# Altium schematic sheet Gorilla OP schm.SchDoc
size A3
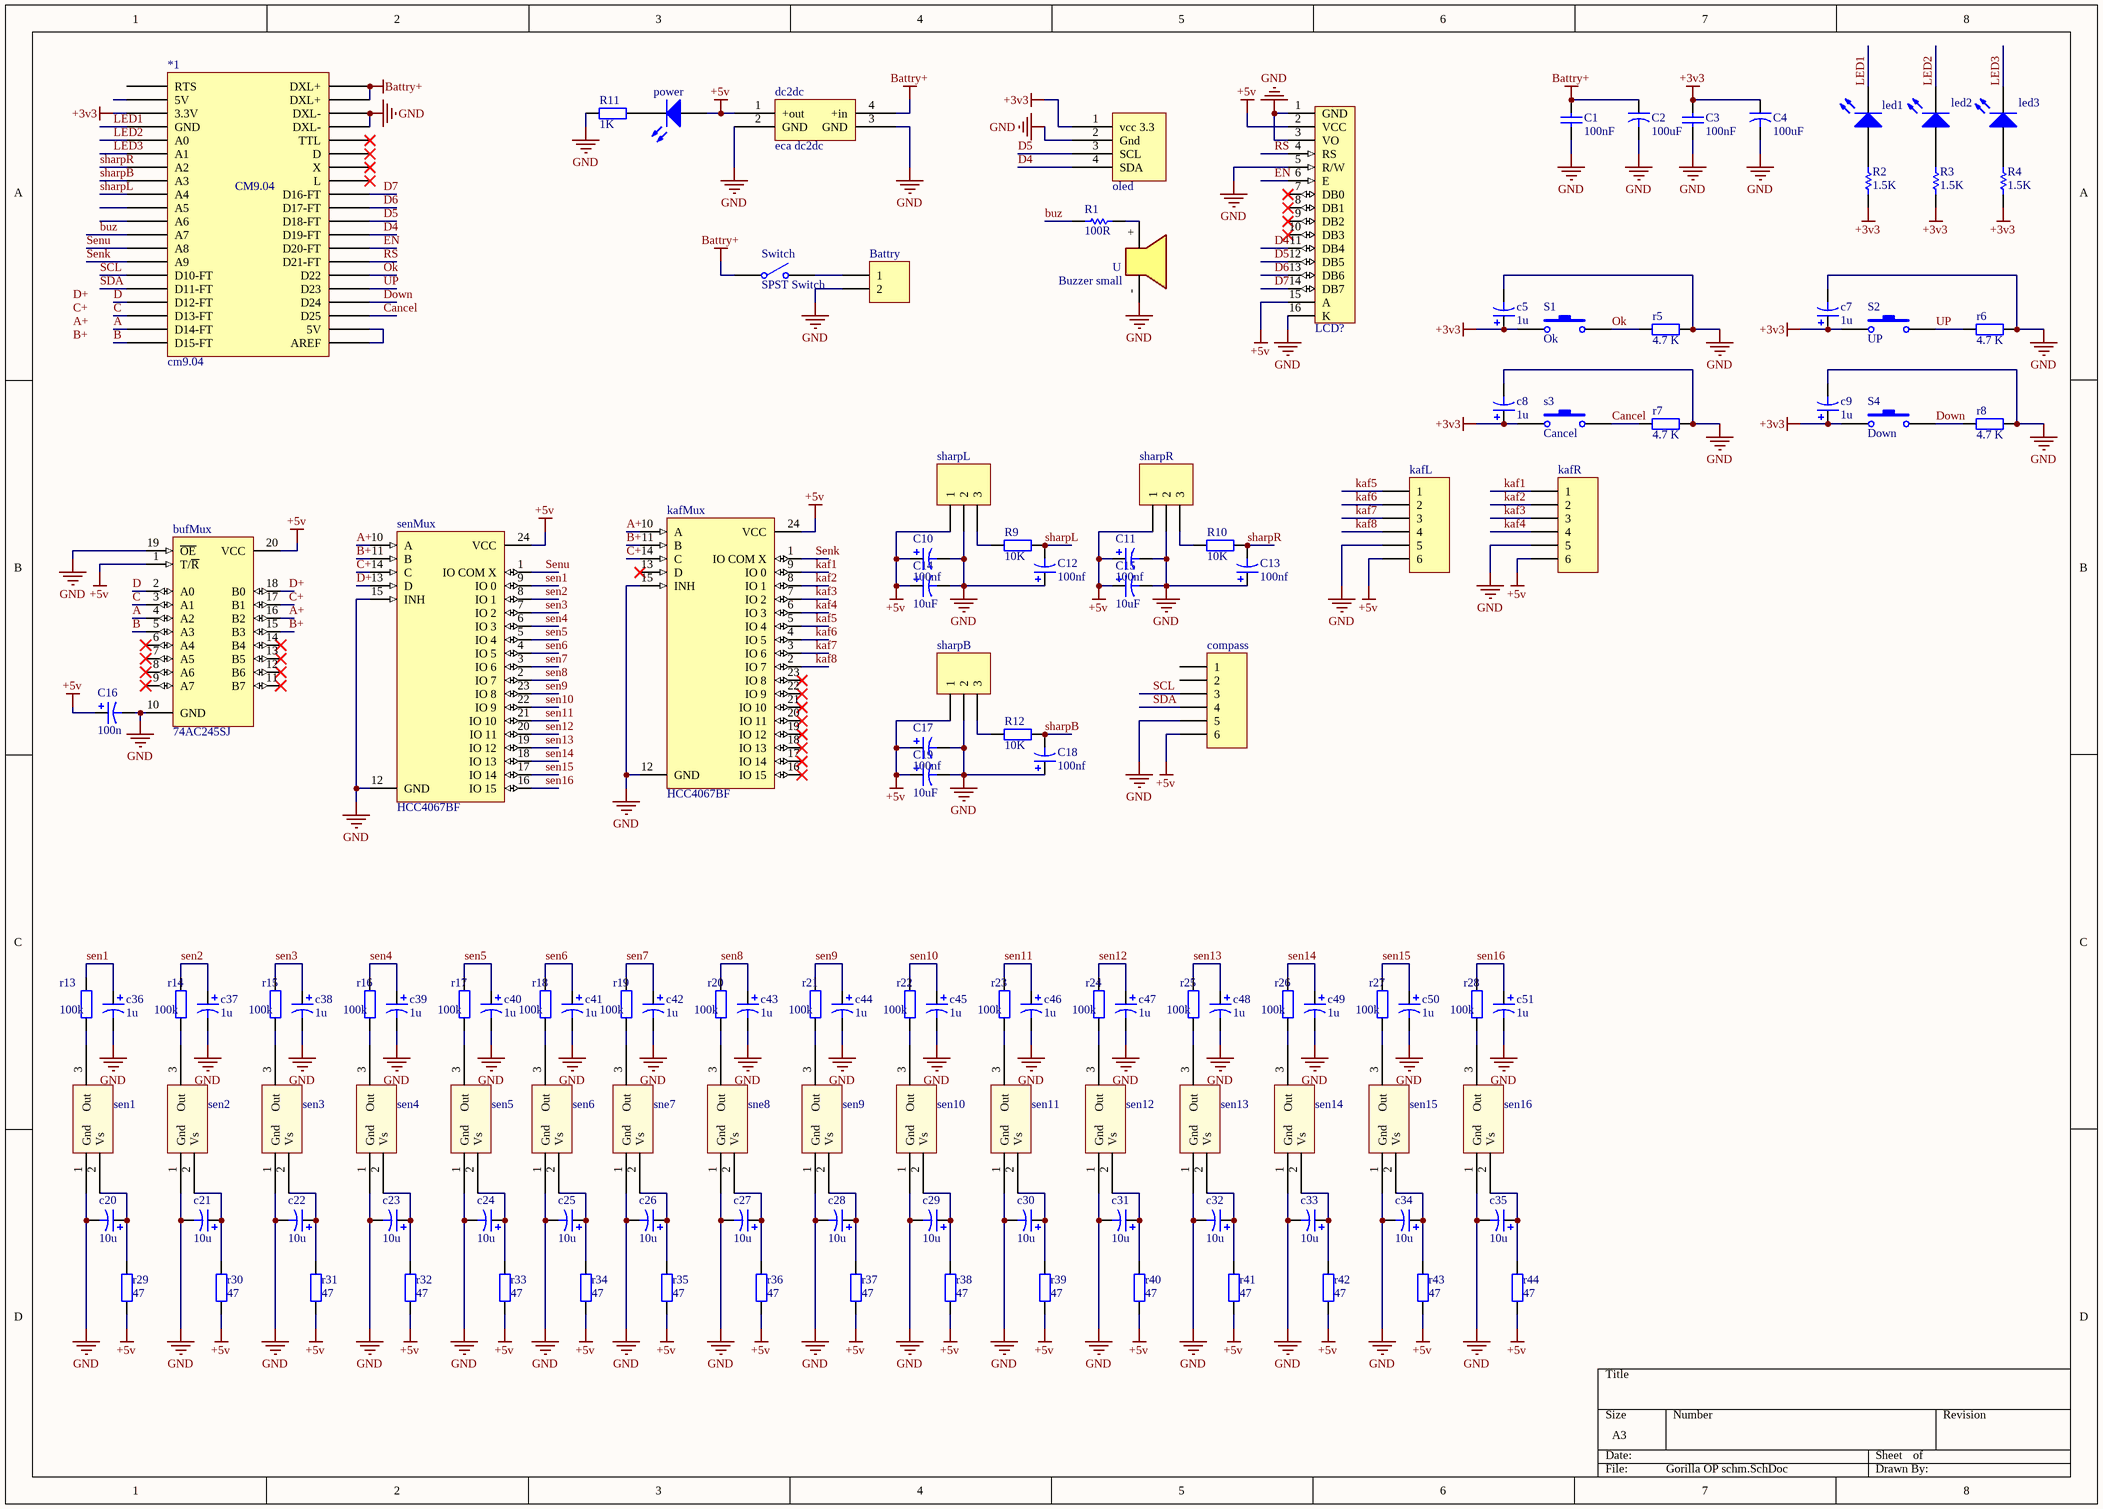
[diagram p0: Gorilla OP schm.SchDoc]

## Parts
*1  cm9.04  [cm9.04]
Battry  Header 2  [PINH-2]  (value not drawn)
bufMux  74AC245SJ  [M20D_N]
C1  100nF  [C0805]
C2  100uF  [Cap 220uF 16V smd]
C3  100nF  [C0805]
C4  100uF  [Cap 220uF 16V smd]
c5  1u  [C0805]
c7  1u  [C0805]
c8  1u  [C0805]
c9  1u  [C0805]
C10  100nf  [C0805]
C11  100nf  [C0805]
C12  100nf  [C0805]
C13  100nf  [C0805]
C14  10uF  [C0805]
C15  10uF  [C0805]
C16  100n  [C0805]
C17  100nf  [C0805]
C18  100nf  [C0805]
C19  10uF  [C0805]
c20  10u  [C0805]
c21  10u  [C0805]
c22  10u  [C0805]
c23  10u  [C0805]
c24  10u  [C0805]
c25  10u  [C0805]
c26  10u  [C0805]
c27  10u  [C0805]
c28  10u  [C0805]
c29  10u  [C0805]
c30  10u  [C0805]
c31  10u  [C0805]
c32  10u  [C0805]
c33  10u  [C0805]
c34  10u  [C0805]
c35  10u  [C0805]
c36  1u  [C0805]
c37  1u  [C0805]
c38  1u  [C0805]
c39  1u  [C0805]
c40  1u  [C0805]
c41  1u  [C0805]
c42  1u  [C0805]
c43  1u  [C0805]
c44  1u  [C0805]
c45  1u  [C0805]
c46  1u  [C0805]
c47  1u  [C0805]
c48  1u  [C0805]
c49  1u  [C0805]
c50  1u  [C0805]
c51  1u  [C0805]
compass  Header 6  [PINH-6]  (value not drawn)
dc2dc  eca dc2dc  [eca dc2dc]
kafL  Header 6  [PINH-6]  (value not drawn)
kafMux  HCC4067BF  [CDIP24]
kafR  Header 6  [PINH-6]  (value not drawn)
LCD?  LCD 16X2  [LCD 16x2-A]  (value not drawn)
led1  Red  [LED 1206]  (value not drawn)
led2  Blue  [LED 1206]  (value not drawn)
led3  White  [LED 1206]  (value not drawn)
oled  ssd 1306 oled  [ssd 1306 oled]  (value not drawn)
power  LED  [LED 1206]  (value not drawn)
R1  value 100R  [2012[0805]]
R2  1.5K  [2012[0805]]
R3  1.5K  [2012[0805]]
R4  1.5K  [2012[0805]]
r5  4.7 K  [2012[0805]]
r6  4.7 K  [2012[0805]]
r7  4.7 K  [2012[0805]]
r8  4.7 K  [2012[0805]]
R9  10K  [2012[0805]]
R10  10K  [2012[0805]]
R11  1K  [2012[0805]]
R12  10K  [2012[0805]]
r13  100k  [2012[0805]]
r14  100k  [2012[0805]]
r15  100k  [2012[0805]]
r16  100k  [2012[0805]]
r17  100k  [2012[0805]]
r18  100k  [2012[0805]]
r19  100k  [2012[0805]]
r20  100k  [2012[0805]]
r21  100k  [2012[0805]]
r22  100k  [2012[0805]]
r23  100k  [2012[0805]]
r24  100k  [2012[0805]]
r25  100k  [2012[0805]]
r26  100k  [2012[0805]]
r27  100k  [2012[0805]]
r28  100k  [2012[0805]]
r29  47  [2012[0805]]
r30  47  [2012[0805]]
r31  47  [2012[0805]]
r32  47  [2012[0805]]
r33  47  [2012[0805]]
r34  47  [2012[0805]]
r35  47  [2012[0805]]
r36  47  [2012[0805]]
r37  47  [2012[0805]]
r38  47  [2012[0805]]
r39  47  [2012[0805]]
r40  47  [2012[0805]]
r41  47  [2012[0805]]
r42  47  [2012[0805]]
r43  47  [2012[0805]]
r44  47  [2012[0805]]
S1  Ok  [tak switch smd]
S2  UP  [tak switch smd]
s3  Cancel  [tak switch smd]
S4  Down  [tak switch smd]
sen1  tsop  [tsop]  (value not drawn)
sen2  tsop  [tsop]  (value not drawn)
sen3  tsop  [tsop]  (value not drawn)
sen4  tsop  [tsop]  (value not drawn)
sen5  tsop  [tsop]  (value not drawn)
sen6  tsop  [tsop]  (value not drawn)
sen9  tsop  [tsop]  (value not drawn)
sen10  tsop  [tsop]  (value not drawn)
sen11  tsop  [tsop]  (value not drawn)
sen12  tsop  [tsop]  (value not drawn)
sen13  tsop  [tsop]  (value not drawn)
sen14  tsop  [tsop]  (value not drawn)
sen15  tsop  [tsop]  (value not drawn)
sen16  tsop  [tsop]  (value not drawn)
senMux  HCC4067BF  [CDIP24]
sharpB  Header 3  [PINH-3]  (value not drawn)
sharpL  Header 3  [PINH-3]  (value not drawn)
sharpR  Header 3  [PINH-3]  (value not drawn)
sne7  tsop  [tsop]  (value not drawn)
sne8  tsop  [tsop]  (value not drawn)
Switch  SPST Switch  [Rocker]
U  Buzzer small  [Buzzer]

## Nets
+3v3: *1.3(3.3V) C3.2 C4.1 c5.1 c7.1 c8.1 c9.1 oled.1(vcc_3.3) R2.2 R3.2 R4.2 S1.1 S2.1 s3.1 S4.1
+5v: bufMux.1(T/~{R}) bufMux.20(VCC) C10.1 C11.1 C14.1 C15.1 C16.1 C17.1 C19.1 compass.6 dc2dc.1(+out) kafL.6 kafMux.24(VCC) kafR.6 LCD?.2(VCC) LCD?.15(A) power.1(A) r29.2 r30.2 r31.2 r32.2 r33.2 r34.2 r35.2 r36.2 r37.2 r38.2 r39.2 r40.2 r41.2 r42.2 r43.2 r44.2 senMux.24(VCC) sharpB.1 sharpL.1 sharpR.1
Battry+: *1.39(DXL+) *1.40(DXL+) C1.2 C2.1 dc2dc.4(+in) Switch.1(COMMON)
GND: *1.37(DXL-) *1.38(DXL-) Battry.2 bufMux.10(GND) bufMux.19(~{OE}) C1.1 C2.2 C3.1 C4.2 c5.2 c7.2 c8.2 c9.2 C10.2 C11.2 C12.1 C13.1 C14.2 C15.2 C16.2 C17.2 C18.1 C19.2 c20.2 c21.2 c22.2 c23.2 c24.2 c25.2 c26.2 c27.2 c28.2 c29.2 c30.2 c31.2 c32.2 c33.2 c34.2 c35.2 c36.2 c37.2 c38.2 c39.2 c40.2 c41.2 c42.2 c43.2 c44.2 c45.2 c46.2 c47.2 c48.2 c49.2 c50.2 c51.2 compass.5 dc2dc.2(GND) dc2dc.3(GND) kafL.5 kafMux.12(GND) kafMux.15(INH) kafR.5 LCD?.1(GND) LCD?.3(VO) LCD?.5(R/W) LCD?.16(K) oled.2(Gnd) r5.1 r6.1 r7.1 r8.1 R11.2 sen1.1(Gnd) sen2.1(Gnd) sen3.1(Gnd) sen4.1(Gnd) sen5.1(Gnd) sen6.1(Gnd) sen9.1(Gnd) sen10.1(Gnd) sen11.1(Gnd) sen12.1(Gnd) sen13.1(Gnd) sen14.1(Gnd) sen15.1(Gnd) sen16.1(Gnd) senMux.12(GND) senMux.15(INH) sharpB.2 sharpL.2 sharpR.2 sne7.1(Gnd) sne8.1(Gnd) U.-
A: *1.19(D14-FT) bufMux.4(A2)
A+: bufMux.16(B2) kafMux.10(A) senMux.10(A)
B: *1.20(D15-FT) bufMux.5(A3)
B+: bufMux.15(B3) kafMux.11(B) senMux.11(B)
buz: *1.12(A7) R1.1
C: *1.18(D13-FT) bufMux.3(A1)
C+: bufMux.17(B1) kafMux.14(C) senMux.14(C)
Cancel: *1.23(D25) r7.2 s3.2
D: *1.17(D12-FT) bufMux.2(A0)
D4: *1.29(D19-FT) LCD?.11(DB4) oled.4(SDA)
D5: *1.30(D18-FT) LCD?.12(DB5) oled.3(SCL)
D6: *1.31(D17-FT) LCD?.13(DB6)
D7: *1.32(D16-FT) LCD?.14(DB7)
D+: bufMux.18(B0) senMux.13(D)
Down: *1.24(D24) r8.2 S4.2
EN: *1.28(D20-FT) LCD?.6(E)
kaf1: kafMux.9(IO_0) kafR.1
kaf2: kafMux.8(IO_1) kafR.2
kaf3: kafMux.7(IO_2) kafR.3
kaf4: kafMux.6(IO_3) kafR.4
kaf5: kafL.1 kafMux.5(IO_4)
kaf6: kafL.2 kafMux.4(IO_5)
kaf7: kafL.3 kafMux.3(IO_6)
kaf8: kafL.4 kafMux.2(IO_7)
LED1: *1.4(GND) led1.2(K)
LED2: *1.5(A0) led2.2(K)
LED3: *1.6(A1) led3.2(K)
Ok: *1.26(D22) r5.2 S1.2
RS: *1.27(D21-FT) LCD?.4(RS)
SCL: *1.15(D10-FT) compass.3
SDA: *1.16(D11-FT) compass.4
sen1: c36.1 r13.1 senMux.9(IO_0)
sen2: c37.1 r14.1 senMux.8(IO_1)
sen3: c38.1 r15.1 senMux.7(IO_2)
sen4: c39.1 r16.1 senMux.6(IO_3)
sen5: c40.1 r17.1 senMux.5(IO_4)
sen6: c41.1 r18.1 senMux.4(IO_5)
sen7: c42.1 r19.1 senMux.3(IO_6)
sen8: c43.1 r20.1 senMux.2(IO_7)
sen9: c44.1 r21.1 senMux.23(IO_8)
sen10: c45.1 r22.1 senMux.22(IO_9)
sen11: c46.1 r23.1 senMux.21(IO_10)
sen12: c47.1 r24.1 senMux.20(IO_11)
sen13: c48.1 r25.1 senMux.19(IO_12)
sen14: c49.1 r26.1 senMux.18(IO_13)
sen15: c50.1 r27.1 senMux.17(IO_14)
sen16: c51.1 r28.1 senMux.16(IO_15)
Senk: *1.14(A9) kafMux.1(IO_COM_X)
Senu: *1.13(A8) senMux.1(IO_COM_X)
sharpB: *1.8(A3) C18.2 R12.1
sharpL: *1.9(A4) C12.2 R9.1
sharpR: *1.7(A2) C13.2 R10.1
UP: *1.25(D23) r6.2 S2.2
Net*1_21: *1.21(AREF) *1.22(5V)
NetBattry_1: Battry.1 Switch.2(NO)
Netc20_1: c20.1 r29.1 sen1.2(Vs)
Netc21_1: c21.1 r30.1 sen2.2(Vs)
Netc22_1: c22.1 r31.1 sen3.2(Vs)
Netc23_1: c23.1 r32.1 sen4.2(Vs)
Netc24_1: c24.1 r33.1 sen5.2(Vs)
Netc25_1: c25.1 r34.1 sen6.2(Vs)
Netc26_1: c26.1 r35.1 sne7.2(Vs)
Netc27_1: c27.1 r36.1 sne8.2(Vs)
Netc28_1: c28.1 r37.1 sen9.2(Vs)
Netc29_1: c29.1 r38.1 sen10.2(Vs)
Netc30_1: c30.1 r39.1 sen11.2(Vs)
Netc31_1: c31.1 r40.1 sen12.2(Vs)
Netc32_1: c32.1 r41.1 sen13.2(Vs)
Netc33_1: c33.1 r42.1 sen14.2(Vs)
Netc34_1: c34.1 r43.1 sen15.2(Vs)
Netc35_1: c35.1 r44.1 sen16.2(Vs)
Netled1_1: led1.1(A) R2.1
Netled2_1: led2.1(A) R3.1
Netled3_1: led3.1(A) R4.1
Netpower_2: power.2(K) R11.1
NetR1_2: R1.2 U.+
NetR9_2: R9.2 sharpL.3
NetR10_2: R10.2 sharpR.3
NetR12_2: R12.2 sharpB.3
Netr13_2: r13.2 sen1.3(Out)
Netr14_2: r14.2 sen2.3(Out)
Netr15_2: r15.2 sen3.3(Out)
Netr16_2: r16.2 sen4.3(Out)
Netr17_2: r17.2 sen5.3(Out)
Netr18_2: r18.2 sen6.3(Out)
Netr19_2: r19.2 sne7.3(Out)
Netr20_2: r20.2 sne8.3(Out)
Netr21_2: r21.2 sen9.3(Out)
Netr22_2: r22.2 sen10.3(Out)
Netr23_2: r23.2 sen11.3(Out)
Netr24_2: r24.2 sen12.3(Out)
Netr25_2: r25.2 sen13.3(Out)
Netr26_2: r26.2 sen14.3(Out)
Netr27_2: r27.2 sen15.3(Out)
Netr28_2: r28.2 sen16.3(Out)

Not connected (* = marked no-connect by the designer): *1 1(RTS) 2(5V) 10(A5) 11(A6) 33(L)* 34(X)* 35(D)* 36(TTL)*; bufMux 6(A4)* 7(A5)* 8(A6)* 9(A7)* 11(B7)* 12(B6)* 13(B5)* 14(B4)*; compass 1 2; kafMux 13(D)* 16(IO_15)* 17(IO_14)* 18(IO_13)* 19(IO_12)* 20(IO_11)* 21(IO_10)* 22(IO_9)* 23(IO_8)*; LCD? 7(DB0)* 8(DB1)* 9(DB2)* 10(DB3)*

## Notes on the sheet
- Labels drawn without touching a wire or pin: A+, B+, C+, D+
- (in symbol cm9.04) CM9.04

## Library data of the parts
Battry = Header 2: Header, 2-Pin; LatestRevisionDate: 17-Jul-2002; LatestRevisionNote: Re-released for DXP Platform.; Publisher: Altium Limited
bufMux = 74AC245SJ: Octal Bidirectional Transceiver with 3-State Input/Output; Published: 17-Jul-2002; LatestRevisionDate: 13-Apr-2006; LatestRevisionNote: IPC-7351 Footprint Added.; DatasheetVersion: Nov-1999; PackageVersion: 2000; PackageReference: M20D; Publisher: Altium Limited; PackageDescription: 20-Pin Small Outline Package 1.27 mm Pitch; ComponentLink1Description: Manufacturer Link; ComponentLink1URL: http://www.fairchildsemi.com/; ComponentLink2Description: Datasheet; ComponentLink2URL: http://www.fairchildsemi.com/ds/74%2F74AC245.pdf
C1 C3 = Cap Semi: Capacitor (Semiconductor SIM Model); Published: 8-Jun-2000; LatestRevisionDate: 29-May-2009; LatestRevisionNote: IPC-7351 Footprint Added.; PackageReference: C1206; Publisher: Altium Limited; PackageDescription: Chip Capacitor; Value: 100nF
C2 C4 = Cap2: Capacitor; Value: 100pF; Published: 23-Sep-2002; PackageReference: CAPR5-4X5; Publisher: Altium Limited
c5 c7-c9 C10-C19 c20-c51 = CAP-POL: Polarized Capacitor; Type: Electrolit (Radial)
compass kafL kafR = Header 6: Header, 6-Pin; LatestRevisionDate: 17-Jul-2002; LatestRevisionNote: Re-released for DXP Platform.; Publisher: Altium Limited
kafMux senMux = HCC4067BF: Analog Multiplexer/Demultiplexer; Published: 8-Jun-2000; LatestRevisionDate: 06-Jun-2005; LatestRevisionNote: Stylized 3D Model Added.; DatasheetVersion: Sep-1988; PackageVersion: Sep-1988; PackageReference: CDIP24; Publisher: Altium Limited; PackageDescription: DIP; 24 Leads; Row Spacing 15.24 mm; Pitch 2.54 mm; ComponentLink1Description: Manufacturer Link; ComponentLink1URL: http://www.st.com/
LCD? = LCD 16X2: LCD 16X2 Character lcd
led1-led3 = LED3: Typical BLUE SiC LED; Published: 8-Jun-2000; LatestRevisionDate: 17-Dec-2003; LatestRevisionNote: PCB Footprint replaced.; DatasheetDocument: 16-Apr-2002; PackageDocument: 16-Apr-2002; PackageReference: 3.5X2.8X1.9; Publisher: Altium Limited
power = LED: General Propuse Ga/As LED
R1 = Res1: Resistor; Published: 8-Jun-2000; LatestRevisionDate: 17-Jul-2002; LatestRevisionNote: Re-released for DXP Platform.; PackageReference: AXIAL-0.3; Publisher: Altium Limited
R2-R4 = Res Semi: Semiconductor Resistor; Published: 8-Jun-2000; LatestRevisionDate: 17-Jul-2002; LatestRevisionNote: Re-released for DXP Platform.; PackageReference: AXIAL-0.5; Publisher: Altium Limited; Value: 1.5K
r5-r8 R9-R12 r13-r44 = Resistor
S1 S2 s3 S4 = SW-PB: Push Botton Switch
sharpB sharpL sharpR = Header 3: Header, 3-Pin; LatestRevisionDate: 17-Jul-2002; LatestRevisionNote: Re-released for DXP Platform.; Publisher: Altium Limited
Switch = SW-SPST: SPST Switch on/off Application
U = Buzzer: 5-12v small buzzer (12mm)